# EAGLE design dcfsim (EAGLE 6.4)
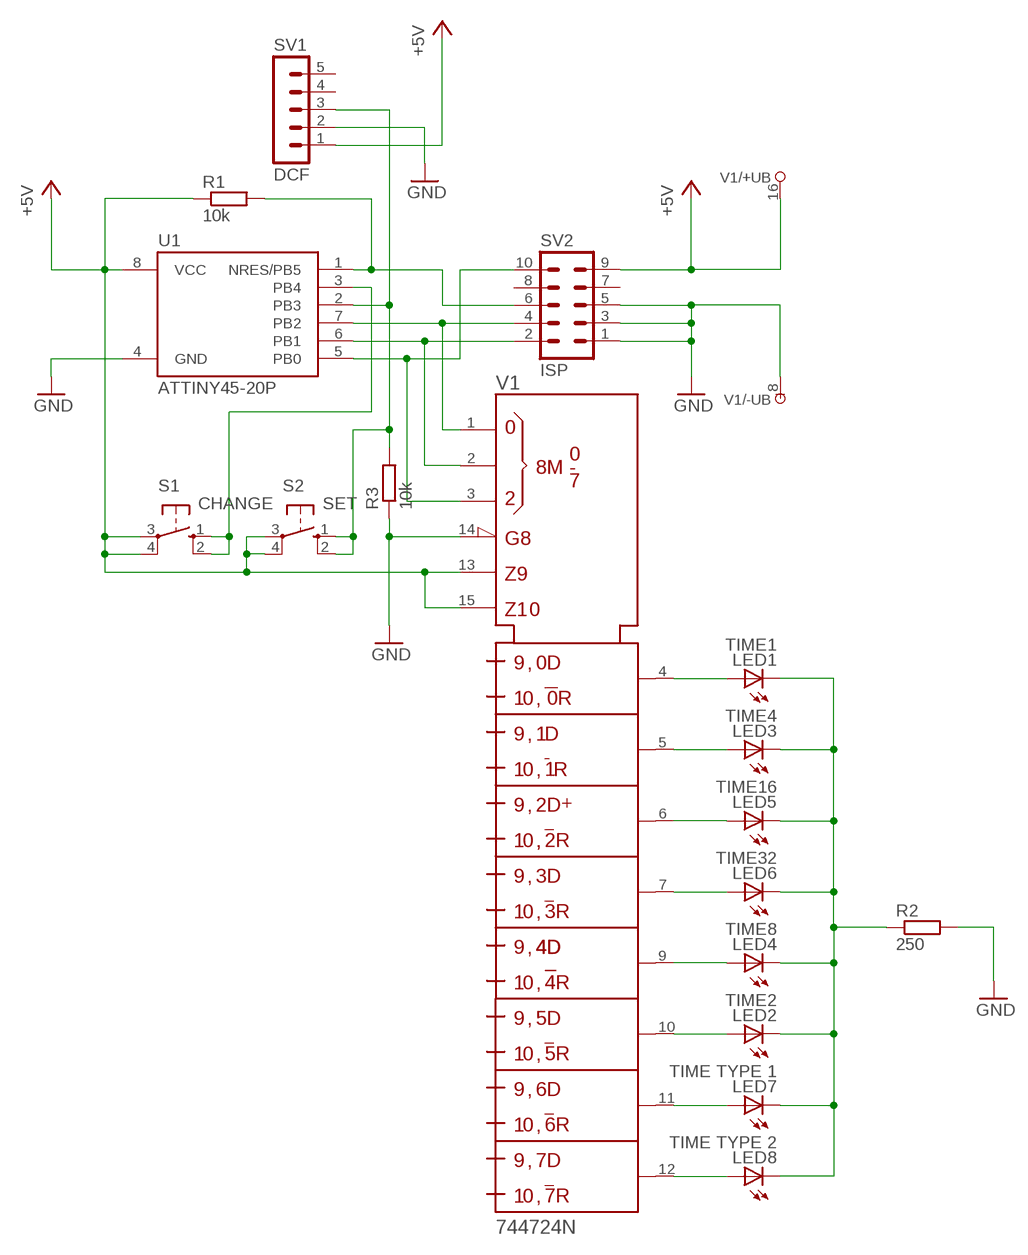
[diagram p0: schematic, sheet 1]

## Parts
LED1  TIME1  LED5MM  [LED5MM]
LED2  TIME2  LED5MM  [LED5MM]
LED3  TIME4  LED5MM  [LED5MM]
LED4  TIME8  LED5MM  [LED5MM]
LED5  TIME16  LED5MM  [LED5MM]
LED6  TIME32  LED5MM  [LED5MM]
LED7  TIME TYPE 1  LED5MM  [LED5MM]
LED8  TIME TYPE 2  LED5MM  [LED5MM]
R1  10k  R-EU_0204/5  [0204/5]
R2  250  R-EU_0204/5  [0204/5]
R3  10k  R-EU_0204/5  [0204/5]
S1  CHANGE  10-XX  [B3F-10XX]
S2  SET  10-XX  [B3F-10XX]
SV1  DCF  MA05-1  [MA05-1]
SV2  ISP  ML10  [ML10]
U1  ATTINY45-20P  [PDIP08_300MIL]
V1  744724N  [DIL16]

## Nets
+5V: R1.1 S1.3(P) S1.4(P1) S2.3(P) S2.4(P1) SV1.1 SV2.9 U1.8(VCC) V1.13(D) V1.15(CLR) V1.16(+UB)
GND: R2.2 R3.1 SV1.2 SV2.1 SV2.3 SV2.5 U1.4(GND) V1.8(-UB) V1.14(!G)
N$1: R1.2 SV2.6 U1.1(NRES/PB5)
N$2: SV2.4 U1.7(PB2) V1.1(S0)
N$3: SV2.2 U1.6(PB1) V1.2(S1)
N$4: SV2.10 U1.5(PB0) V1.3(S2)
N$5: R3.2 S2.1(S) S2.2(S1) SV1.3 U1.2(PB3)
N$6: LED1.A V1.4(Q0)
N$7: LED2.A V1.10(Q5)
N$8: LED4.A V1.9(Q4)
N$9: LED6.A V1.7(Q3)
N$10: LED5.A V1.6(Q2)
N$11: LED3.A V1.5(Q1)
N$13: S1.1(S) S1.2(S1) U1.3(PB4)
N$14: LED7.A V1.11(Q6)
N$15: LED8.A V1.12(Q7)
RROU: LED1.K(C) LED2.K(C) LED3.K(C) LED4.K(C) LED5.K(C) LED6.K(C) LED7.K(C) LED8.K(C) R2.1
Unconnected: SV1.4 SV1.5 SV2.7 SV2.8

## Library data of the parts
LED1-LED8 = led:LED: LED OSRAM: - CHIPLED LG R971, LG N971, LY N971, LG Q971, LY Q971, LO R971, LY R971 LH N974, LH R974 LS Q976, LO Q976, LY Q976 LO Q996 - Hyper CHIPLED LW Q18S LB Q993, LB Q99A, LB R99A - SideLED LS A670, LO A670, LY A670, LG A670, LP A670 LB A673, LV A673, LT A673, LW A673 LH A674 LY A675 LS A676, LA A676, LO A676, LY A676, LW A676 LS A679, LY A679, LG A679 - Hyper Micro SIDELED® LS Y876, LA Y876, LO Y876, LY Y876 LT Y87S - SmartLED LW L88C, LW L88S LB L89C, LB L89S, LG L890 LS L89K, LO L89K, LY L89K LS L896, LA L896, LO L896, LY L896 - TOPLED LS T670, LO T670, LY T670, LG T670, LP T670 LSG T670, LSP T670, LSY T670, LOP T670, LYG T670 LG T671, LOG T671, LSG T671 LB T673, LV T673, LT T673, LW T673 LH T674 LS T676, LA T676, LO T676, LY T676, LB T676, LH T676, LSB T676, LW T676 LB T67C, LV T67C, LT T67C, LS T67K, LO T67K, LY T67K, LW E67C LS E67B, LA E67B, LO E67B, LY E67B, LB E67C, LV E67C, LT E67C LW T67C LS T679, LY T679, LG T679 LS T770, LO T770, LY T770, LG T770, LP T770 LB T773, LV T773, LT T773, LW T773 LH T774 LS E675, LA E675, LY E675, LS T675 LS T776, LA T776, LO T776, LY T776, LB T776 LHGB T686 LT T68C, LB T68C - Hyper Mini TOPLED® LB M676 - Mini TOPLED Santana® LG M470 LS M47K, LO M47K, LY M47K Source: http://www.osram.convergy.de LUXEON: - LUMILED® LXK2-PW12-R00, LXK2-PW12-S00, LXK2-PW14-U00, LXK2-PW14-V00 LXK2-PM12-R00, LXK2-PM12-S00, LXK2-PM14-U00 LXK2-PE12-Q00, LXK2-PE12-R00, LXK2-PE12-S00, LXK2-PE14-T00, LXK2-PE14-U00 LXK2-PB12-K00, LXK2-PB12-L00, LXK2-PB12-M00, LXK2-PB14-N00, LXK2-PB14-P00, LXK2-PB14-Q00 LXK2-PR12-L00, LXK2-PR12-M00, LXK2-PR14-Q00, LXK2-PR14-R00 LXK2-PD12-Q00, LXK2-PD12-R00, LXK2-PD12-S00 LXK2-PH12-R00, LXK2-PH12-S00 LXK2-PL12-P00, LXK2-PL12-Q00, LXK2-PL12-R00 Source: www.luxeon.com KINGBRIGHT: KA-3528ASYC Source: www.kingbright.com
R1-R3 = resistor:R-EU_: RESISTOR, European symbol
S1 S2 = switch-omron:10-XX: OMRON SWITCH; MPN: B3F-1000; OC_FARNELL: 176432; OC_NEWARK: 36M3542
SV1 = con-lstb:MA05-1: PIN HEADER; OC_FARNELL: unknown; OC_NEWARK: unknown
SV2 = con-harting-ml:ML10: HARTING; OC_FARNELL: unknown; OC_NEWARK: unknown
U1 = _hhn_attiny25_45_85:ATTINY45*: ATMEL ATtiny 45 Packages: P = PDIP 08 30mil S = SOIC 08 EIAJ 208mil X = TSSOP 08 4.4mm Technologies Note: for complete ordering code (temp. range, finish, tape&reel etc.) see www.atmel.com • Supply Voltage: V = (1.8…5.5)V | [blank] = (2.7…5.5)V • Speed: 10 = 10 MHz | 20 = 20 MHz Author: Dipl.-Ing. FH Rainer Bayer HHN Hochschule Heilbronn (Heilbronn University), rainer.bayer@hs-heilbronn.de Ingenieurbüro ing-rb, mail@ing-rb.de
V1 = 74ttl-din:74*4724: 8 Bit Addressable LATCH

## Board
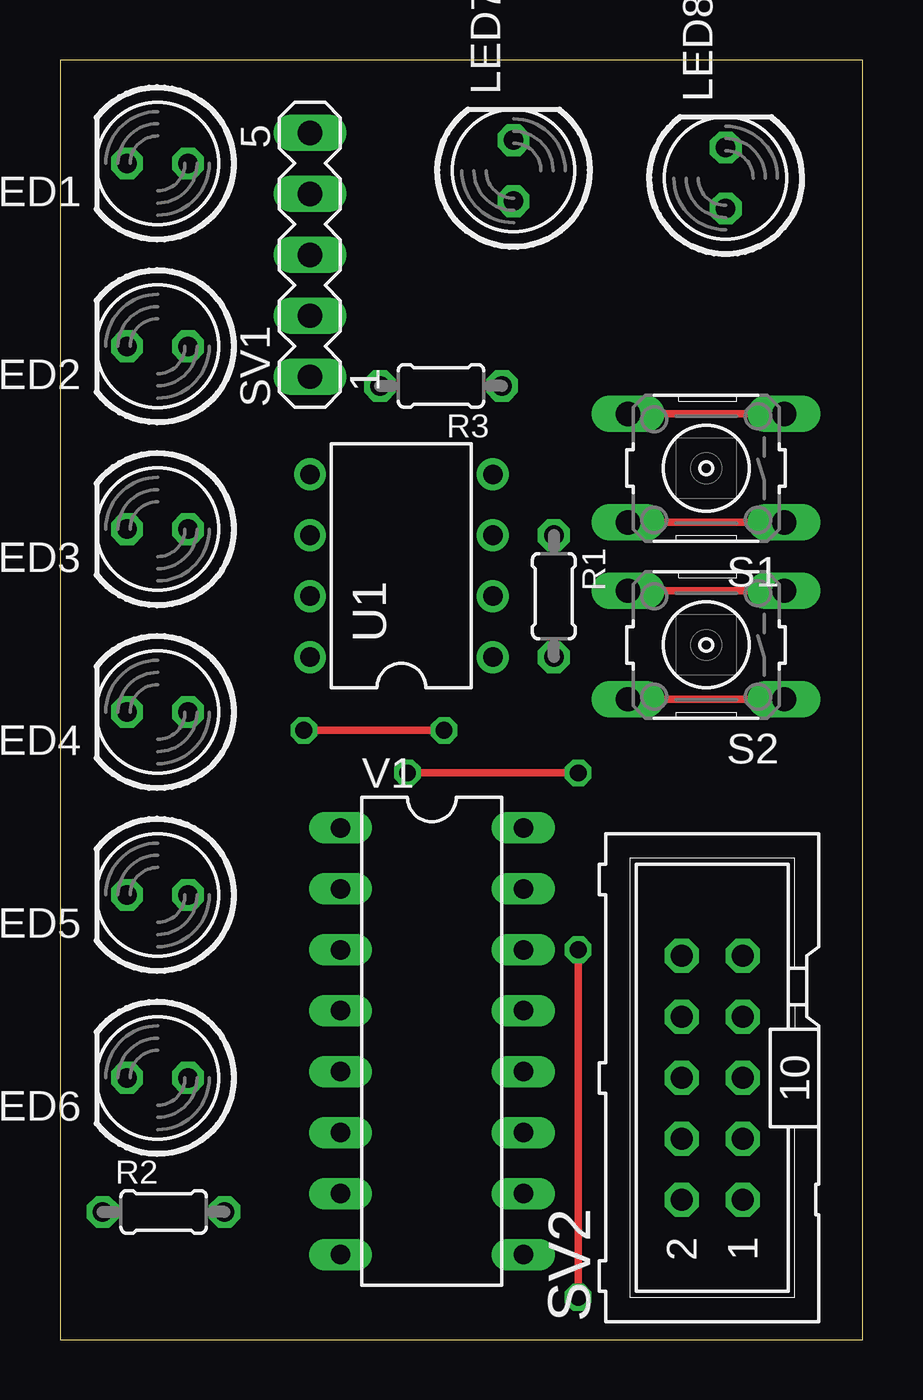
[diagram p1: board, top side]
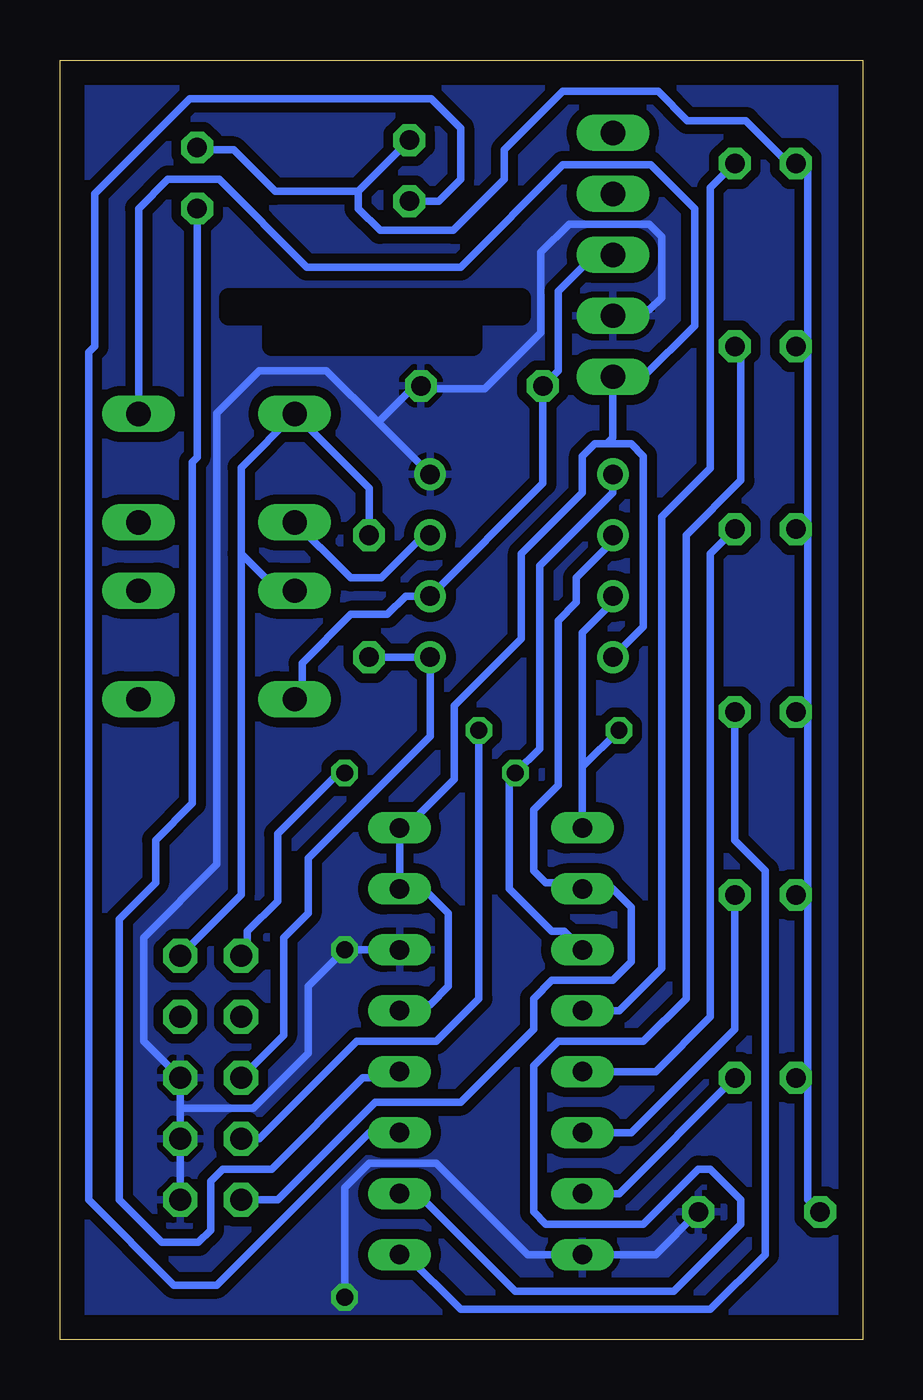
[diagram p2: board, bottom side, seen from below]

Size 33.45 x 53.33 mm. Coordinates in mm from the lower left corner, seen from the top.
Outline: 0,0 33.45,0 33.45,53.33 0,53.33 0,0
Copper layers (1*16): Top 0.035mm / dielectric 1.5mm / Bottom 0.035mm
Design rules "default *": minimum track width 12mil, minimum drill 27mil, track to track 8mil, track to pad 8mil, pad to pad 8mil, via to via 8mil, smd to smd 8mil, copper to edge 40mil, drill to drill 8mil, minimum pad ring 10mil, minimum via ring 8mil, stop-mask expansion 4mil, vias tented up to drill 0mil, thermal gap 10mil
bRestrict: area 16.3,41.4 to 24.6,42.2; area 14.2,42.7 to 26.4,43.4

### Footprints (pad centres in the part's own frame; a part is rotated, then mirrored left to right if it is on the bottom)
LED5MM = drill 0.813 octagon: A -1.27,0; K 1.27,0
0204/5 = drill 0.813 octagon: 1 -2.54,0; 2 2.54,0
B3F-10XX = drill 1.016 long: 1 -3.251,2.261; 2 3.251,2.261; 3 -3.251,-2.261; 4 3.251,-2.261
MA05-1 = drill 1.016 long: 1 -5.08,0; 2 -2.54,0; 3 0,0; 4 2.54,0; 5 5.08,0
ML10 = drill 0.914 octagon: 1 -5.08,-1.27; 2 -5.08,1.27; 3 -2.54,-1.27; 4 -2.54,1.27; 5 0,-1.27; 6 0,1.27; 7 2.54,-1.27; 8 2.54,1.27; 9 5.08,-1.27; 10 5.08,1.27
PDIP08_300MIL = drill 0.813: 1 -3.81,-3.81; 2 -1.27,-3.81; 3 1.27,-3.81; 4 3.81,-3.81; 5 3.81,3.81; 6 1.27,3.81; 7 -1.27,3.81; 8 -3.81,3.81
DIL16 = drill 0.813 long: 1 -8.89,-3.81; 2 -6.35,-3.81; 3 -3.81,-3.81; 4 -1.27,-3.81; 5 1.27,-3.81; 6 3.81,-3.81; 7 6.35,-3.81; 8 8.89,-3.81; 9 8.89,3.81; 10 6.35,3.81; 11 3.81,3.81; 12 1.27,3.81; 13 -1.27,3.81; 14 -3.81,3.81; 15 -6.35,3.81; 16 -8.89,3.81

### Placement (x,y rotation side)
LED1  4.06,49.02 180 top
LED2  4.06,41.4 180 top
LED3  4.06,33.78 180 top
LED4  4.06,26.16 180 top
LED5  4.06,18.54 180 top
LED6  4.06,10.92 180 top
LED7  18.9,48.72 90 top
LED8  27.74,48.41 90 top
R1  20.57,30.99 270 top
R2  4.32,5.33 0 top
R3  15.88,39.75 180 top
S1  26.92,36.32 180 top
S2  26.92,28.96 180 top
SV1  10.41,45.21 90 top
SV2  27.18,10.92 90 top
U1  14.22,32.26 90 top
V1  15.49,12.45 270 top

### Tracks (layer width: path | path; a pad name or v marks a point on that pad's centre or on a via)
+5V
  Top 0.305: S1.3 S1.4 | S2.3 S2.4
  Bottom 0.305: 25.91,32.77 25.91,36.35 S1.4 20.57,35.48 R1.1 | 25.91,32.77 25.91,18.54 SV2.9 | V1.13 19.05,13.97 18.03,13.97 17.27,14.73 17.27,17.78 18.29,18.8 V1.15 V1.16 19.05,21.34 17.02,23.37 17.02,26.42 14.22,29.21 14.22,32.77 11.68,35.31 11.68,36.83 11.18,37.34 10.67,37.34 | 10.67,37.34 9.65,37.34 9.14,36.83 9.14,29.72 U1.8 | 10.67,37.34 10.41,37.59 SV1.1 9.14,40.13 7.01,42.27 7.01,47.14 8.84,48.97 12.5,48.97 16.76,44.7 23.16,44.7 26.82,48.36 28.96,48.36 30.18,47.14 S1.3 | S2.4 24.36,31.22 25.91,32.77
GND  (via drill 0.7)
  Top 0.305: v21.59,16.26 v21.59,1.78
  Bottom 0.305: R2.2 8.64,3.56 V1.8 13.97,3.56 17.78,7.37 20.57,7.37 21.59,6.35 v21.59,1.78 | 28.45,9.65 SV2.5 29.97,12.45 29.97,16.76 26.92,19.81 26.92,38.61 25.15,40.39 22.35,40.39 20.19,38.23 | 28.45,9.65 SV2.1 | 28.45,9.65 25.4,9.65 23.11,11.94 23.11,14.73 v21.59,16.26 V1.14 | SV1.2 10.16,42.93 8.89,42.93 8.38,43.43 8.38,45.97 8.89,46.48 12.24,46.48 13.41,45.31 13.41,41.96 15.75,39.62 18.29,39.62 | U1.4 20.19,38.23 | 18.29,39.62 R3.1 | 18.29,39.62 18.8,39.62 20.19,38.23
  pour Bottom (isolate 0.406): 0.3,0.2 33.22,0.2 33.22,52.93 0.3,52.93 0.3,50.19
N$1
  Bottom 0.305: SV2.6 24.13,12.7 24.13,16.76 23.11,17.78 23.11,20.07 18.03,25.15 U1.1 R1.2
N$2  (via drill 0.7)
  Top 0.305: v10.16,25.4 v16,25.4
  Bottom 0.305: SV2.4 25.15,8.38 21.08,12.45 17.78,12.45 16,14.22 v16,25.4 | U1.7 10.41,30.73 11.68,29.46 11.68,23.88 | 11.68,23.88 V1.1 | v10.16,25.4 11.68,23.88
N$3
  Bottom 0.305: SV2.2 24.38,5.84 20.32,9.91 16.76,9.91 13.72,12.95 13.72,14.22 12.95,14.99 10.41,14.99 9.65,15.75 9.65,18.03 10.41,18.8 V1.2 11.94,19.05 13.21,19.05 13.72,19.56 13.72,22.1 12.7,23.11 12.7,29.97 11.94,30.73 11.94,31.75 10.41,33.27 U1.6
N$4  (via drill 0.7)
  Top 0.305: v14.48,23.62 v21.59,23.62
  Bottom 0.305: V1.3 12.45,17.02 12.95,17.02 14.73,18.8 14.73,23.37 v14.48,23.62 13.46,24.64 13.46,32.26 10.41,35.31 U1.5 | SV2.10 25.65,16.26 25.65,17.02 24.38,18.29 24.38,21.08 21.84,23.62 v21.59,23.62
N$5
  Top 0.305: S2.1 S2.2
  Bottom 0.305: SV1.3 10.67,44.96 11.43,44.96 12.7,43.69 12.7,40.39 R3.2 13.34,35.69 U1.2 19.05,30.99 19.81,30.23 21.34,30.23 23.37,28.19 23.37,27 S2.2
N$6
  Bottom 0.305: V1.4 10.16,13.72 8.38,15.49 8.38,34.29 6.35,36.32 6.35,48.01 LED1.A
N$7
  Bottom 0.305: V1.10 18.54,6.1 14.48,2.03 7.87,2.03 5.08,4.83 5.08,5.84 6.35,7.11 6.86,7.11 9.14,4.83 13.21,4.83 13.72,5.33 13.72,11.43 12.7,12.45 9.14,12.45 7.37,14.22 7.37,33.53 5.08,35.81 5.08,41.15 LED2.A
N$8
  Bottom 0.305: LED4.A 5.33,20.83 4.06,19.56 4.06,3.56 6.35,1.27 16.76,1.27 19.05,3.56 V1.9
N$9
  Bottom 0.305: V1.7 10.16,6.1 LED6.A
N$10
  Bottom 0.305: LED5.A 5.33,12.95 9.65,8.64 V1.6
N$11
  Bottom 0.305: V1.5 8.64,11.18 6.35,13.46 6.35,32.77 LED3.A
N$13
  Top 0.305: S1.1 S1.2
  Bottom 0.305: U1.3 18.29,33.53 20.07,31.75 21.34,31.75 22.61,33.02 22.63,33.02 S1.2
N$14
  Bottom 0.305: V1.11 20.57,8.64 26.92,2.29 28.7,2.29 32.26,5.84 32.26,41.15 32,41.4 32,47.75 28.04,51.71 17.98,51.71 16.76,50.49 16.76,48.36 17.68,47.45 LED7.A
N$15
  Bottom 0.305: V1.12 19.56,10.92 20.83,10.92 24.64,7.11 26.67,7.11 27.18,6.6 27.18,4.57 27.69,4.06 29.21,4.06 30.99,5.84 30.99,17.53 29.46,19.05 29.46,20.83 27.94,22.35 27.94,36.58 27.74,36.78 LED8.A
RROU
  Bottom 0.305: 2.29,41.15 2.29,49.02 LED1.K 3.1,49.02 4.88,50.8 7.32,50.8 8.53,52.02 12.5,52.02 14.94,49.58 14.94,48.36 17.07,46.23 20.12,46.23 21.03,47.14 21.03,47.85 | 2.29,41.15 2.29,34.04 | 2.29,34.04 2.29,25.91 | 2.29,25.91 2.29,18.29 | 2.29,18.29 2.29,10.92 | 2.29,10.92 2.29,5.84 R2.1 | 2.29,34.04 2.54,33.78 LED3.K | 2.29,41.15 2.54,41.4 LED2.K | LED6.K 2.29,10.92 | LED5.K 2.54,18.54 2.29,18.29 | LED4.K 2.54,26.16 2.29,25.91 | 21.03,47.85 24.49,47.85 26.21,49.58 27.64,49.58 LED8.K | 21.03,47.85 LED7.K

### Text on the board
Document: DCF77 Simulator v1 | Yomin@Netz39